# Altium project Rauch.PrjPcb
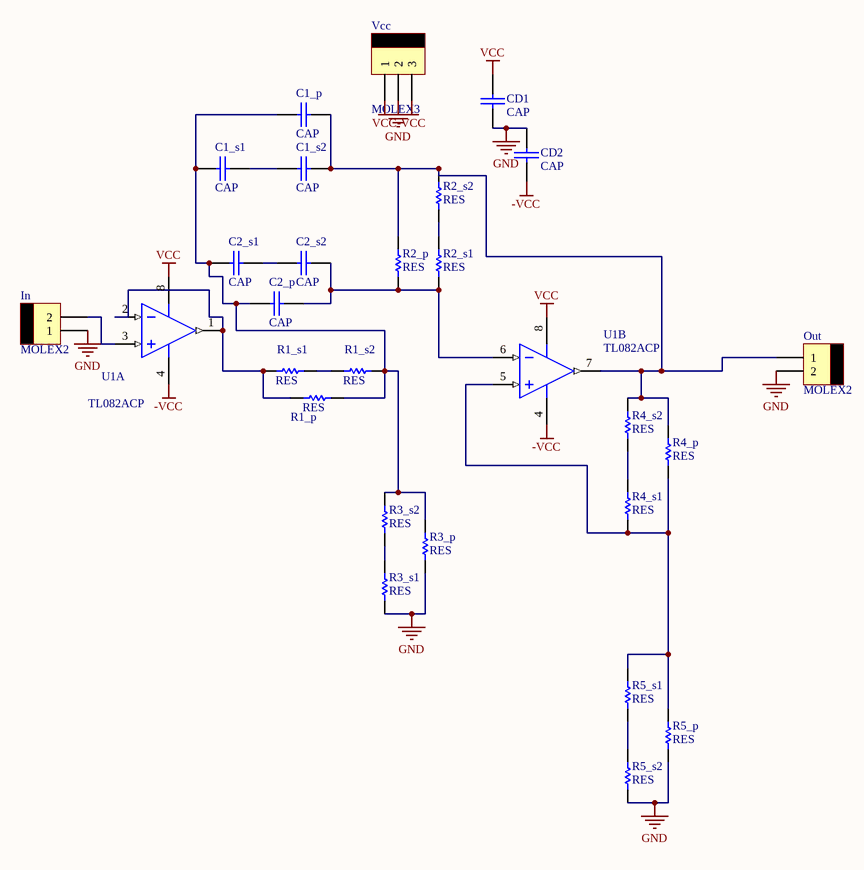
[diagram p0: Rauch.SchDoc]
1 sheet, 27 parts. Net scope: global (net labels, ports and power ports of the same name join across sheets).
Board file: rauch.PcbDoc

## Sheet Rauch.SchDoc
size A

### Parts
C1_p  CAP  [0805]
C1_s1  CAP  [0805]
C1_s2  CAP  [0805]
C2_p  CAP  [0805]
C2_s1  CAP  [0805]
C2_s2  CAP  [0805]
CD1  CAP  [0805]
CD2  CAP  [0805]
In  MOLEX2  [MOLEX2]
Out  MOLEX2  [MOLEX2]
R1_p  RES  [0805]
R1_s1  RES  [0805]
R1_s2  RES  [0805]
R2_p  RES  [0805]
R2_s1  RES  [0805]
R2_s2  RES  [0805]
R3_p  RES  [0805]
R3_s1  RES  [0805]
R3_s2  RES  [0805]
R4_p  RES  [0805]
R4_s1  RES  [0805]
R4_s2  RES  [0805]
R5_p  RES  [0805]
R5_s1  RES  [0805]
R5_s2  RES  [0805]
U1  TL082ACP  [TI-P8]  (parts A,B of 2)
Vcc  MOLEX3  [MOLEX3]

### Nets
-VCC: CD2.2 U1.4(VCC-) Vcc.3
GND: CD1.2 CD2.1 In.1 Out.2 R3_p.1 R3_s1.1 R5_p.1 R5_s2.1 Vcc.2
VCC: CD1.1 U1.8(VCC+) Vcc.1
NetC1_p_1: C1_p.1 C1_s1.1 C2_p.1 C2_s1.1 R1_p.2 R1_s2.2 R3_p.2 R3_s2.2
NetC1_p_2: C1_p.2 C1_s2.2 Out.1 R2_p.2 R2_s2.2 R4_p.2 R4_s2.2 U1.7(OUT2)
NetC1_s1_2: C1_s1.2 C1_s2.1
NetC2_p_2: C2_p.2 C2_s2.2 R2_p.1 R2_s1.1 U1.6(IN2-)
NetC2_s1_2: C2_s1.2 C2_s2.1
NetIn_2: In.2 U1.3(IN1+)
NetR1_p_1: R1_p.1 R1_s1.1 U1.1(OUT1) U1.2(IN1-)
NetR1_s1_2: R1_s1.2 R1_s2.1
NetR2_s1_2: R2_s1.2 R2_s2.1
NetR3_s1_2: R3_s1.2 R3_s2.1
NetR4_p_1: R4_p.1 R4_s1.1 R5_p.2 R5_s1.2 U1.5(IN2+)
NetR4_s1_2: R4_s1.2 R4_s2.1
NetR5_s1_1: R5_s1.1 R5_s2.2

### Library data of the parts
U1 = TL082ACP: JFET-Input Operational Amplifier, 7 to 36 V, 0 to 70 degC, 8-pin DIP (P8), Pb-Free (RoHS); Manufacturer: Texas Instruments; CMRR(Min)(dB): 75; GBW(Typ)(MHz): 3; IIB(Max)(pA): 200; Iq per channel(Max)(mA): 2.8; Number of Channels: 2; Offset Drift(Typ)(uV/C): 18; Rating: Catalog; Slew Rate(Typ)(V/us): 13; Sub Family: General Purpose Amplifier, High Supply Voltage Amplifier (>=30V); Total Supply Voltage(Max)(+5V is 5, +/-5V is 10): 36; Total Supply Voltage(Min)(+5V is 5, +/-5V is 10): 7; Vio (25C)(Max)(mV): 6; DatasheetVersion: SLOS081G; PackageVersion: 4040082/E, 04/2010; PackageReference: P8; PackageDescription: 8-Pin Plastic In-Line, Body 9.59 x 6.35 mm, Pitch 2.54 mm; Supplier 1: Digi-Key; Supplier Part Number 1: 296-1778-5-ND; Supplier 2: Farnell; Supplier Part Number 2: 1103189; Supplier 3: Newark; Supplier Part Number 3: 08F9330; Supplier 4: Mouser; Supplier Part Number 4: 595-TL082ACP; Eco-Plan: Pb-Free (RoHS); Vn at 1kHz(Typ)(nV/rtHz): 18; Mounting Technology: Through Hole; Code_JEDEC: MS-001; PartNumber: TL082ACP; ComponentLink1Description: Manufacturer URL; ComponentLink1URL: http://www.ti.com/; ComponentLink2Description: Datasheet; ComponentLink2URL: http://www.ti.com/lit/ds/symlink/tl082a.pdf; ComponentLink3Description: Package Specification; ComponentLink3URL: http://www.ti.com/litv/pdf/mpdi001b